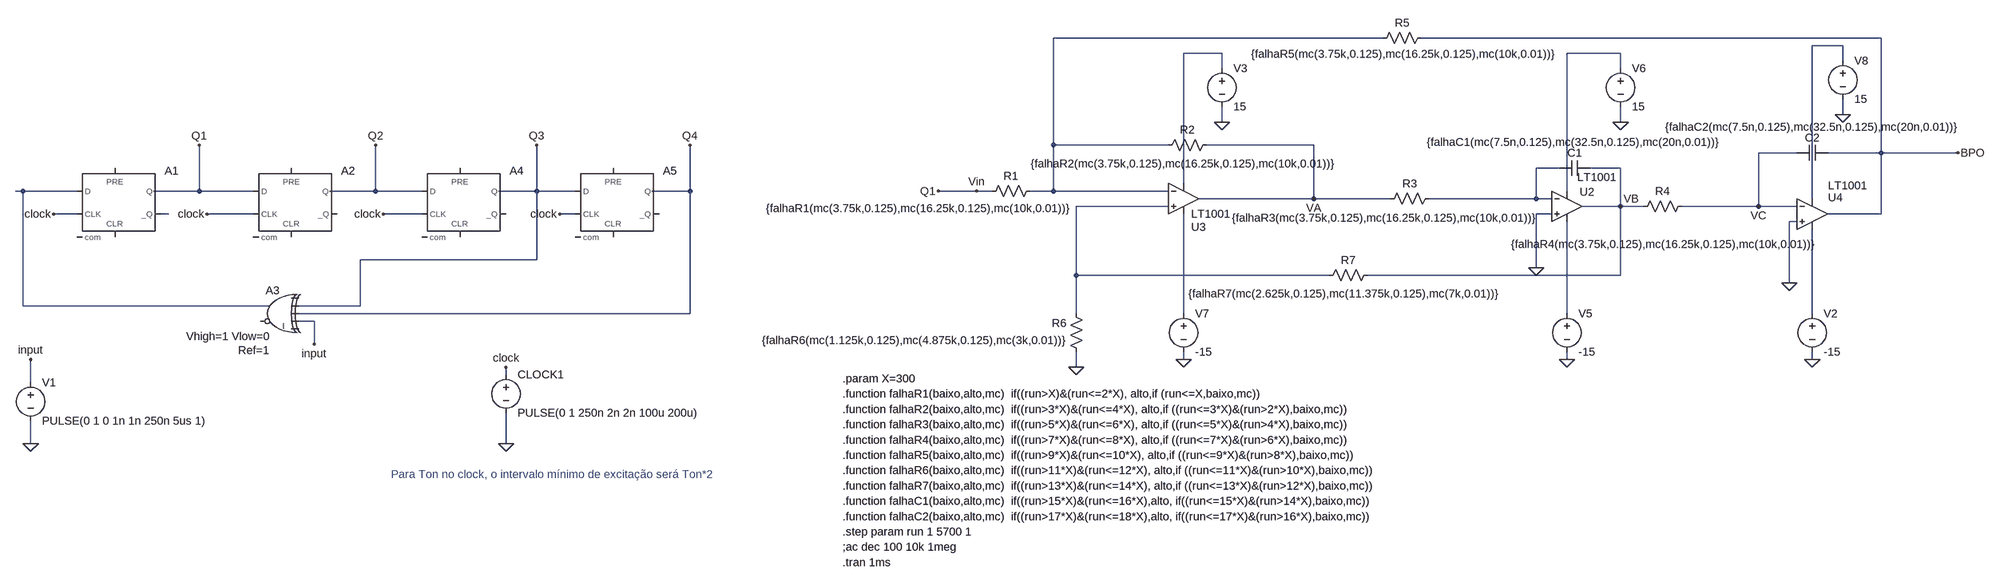
[diagram p0: schematic CTSV mc + 4bitPRBS [FALHA].asc]
CTSV mc + 4bitPRBS [FALHA].asc, the LTspice schematic file:
Version 4
SHEET 1 1748 1376
WIRE 448 -352 -240 -352
WIRE 1488 -352 528 -352
WIRE 1408 -336 1344 -336
WIRE 112 -320 32 -320
WIRE 944 -320 832 -320
WIRE 1408 -304 1408 -336
WIRE 112 -288 112 -320
WIRE 944 -288 944 -320
WIRE 1408 -192 1408 -224
WIRE 112 -176 112 -208
WIRE 944 -176 944 -208
WIRE -240 -128 -240 -352
WIRE 0 -128 -240 -128
WIRE 304 -128 80 -128
WIRE 1312 -112 1232 -112
WIRE 1488 -112 1488 -352
WIRE 1488 -112 1376 -112
WIRE 1648 -112 1488 -112
WIRE 816 -80 768 -80
WIRE 944 -80 880 -80
WIRE 32 -48 32 -320
WIRE -2832 -32 -2848 -32
WIRE -2720 -32 -2832 -32
WIRE -2464 -32 -2464 -128
WIRE -2464 -32 -2560 -32
WIRE -2352 -32 -2464 -32
WIRE -2096 -32 -2096 -128
WIRE -2096 -32 -2192 -32
WIRE -2000 -32 -2096 -32
WIRE -1760 -32 -1760 -128
WIRE -1760 -32 -1840 -32
WIRE -1680 -32 -1760 -32
WIRE -1440 -32 -1440 -128
WIRE -1440 -32 -1520 -32
WIRE -400 -32 -480 -32
WIRE -368 -32 -400 -32
WIRE -240 -32 -240 -128
WIRE -240 -32 -288 -32
WIRE 0 -32 -240 -32
WIRE 832 -32 832 -320
WIRE 304 -16 304 -128
WIRE 304 -16 64 -16
WIRE 464 -16 304 -16
WIRE 768 -16 768 -80
WIRE 768 -16 544 -16
WIRE 800 -16 768 -16
WIRE 1344 -16 1344 -336
WIRE 0 0 -192 0
WIRE 944 0 944 -80
WIRE 944 0 864 0
WIRE 992 0 944 0
WIRE 1232 0 1232 -112
WIRE 1232 0 1072 0
WIRE 1312 0 1232 0
WIRE -2720 16 -2768 16
WIRE -2528 16 -2544 16
WIRE -2352 16 -2448 16
WIRE -2000 16 -2080 16
WIRE -1680 16 -1712 16
WIRE 800 16 768 16
WIRE 1488 16 1488 -112
WIRE 1488 16 1376 16
WIRE 1312 32 1296 32
WIRE -1760 112 -1760 -32
WIRE -1760 112 -2128 112
WIRE 768 128 768 16
WIRE -192 144 -192 0
WIRE 336 144 -192 144
WIRE 944 144 944 0
WIRE 944 144 416 144
WIRE 1296 160 1296 32
WIRE -2832 208 -2832 -32
WIRE -2320 208 -2832 208
WIRE -2128 208 -2128 112
WIRE -2128 208 -2256 208
WIRE -1440 224 -1440 -32
WIRE -1440 224 -2256 224
WIRE -192 224 -192 144
WIRE 32 224 32 16
WIRE 832 224 832 32
WIRE 1344 224 1344 48
WIRE -2224 240 -2256 240
WIRE -2224 288 -2224 240
WIRE 32 320 32 304
WIRE 832 320 832 304
WIRE 1344 320 1344 304
WIRE -192 336 -192 304
WIRE -1824 352 -1824 336
WIRE -2816 368 -2816 320
WIRE -2816 496 -2816 448
WIRE -1824 496 -1824 432
FLAG -400 -32 Vin
FLAG 1344 320 0
FLAG 112 -176 0
FLAG -480 -32 Q1
FLAG 832 320 0
FLAG 944 -176 0
FLAG 32 320 0
FLAG 1408 -192 0
FLAG -192 336 0
FLAG 768 128 0
FLAG 1296 160 0
FLAG 1648 -112 BPO
FLAG 944 0 VB
FLAG 304 -16 VA
FLAG 1232 0 VC
FLAG -1824 496 0
FLAG -2768 16 clock
FLAG -1824 336 clock
FLAG -2448 16 clock
FLAG -2816 496 0
FLAG -2816 320 input
FLAG -2080 16 clock
FLAG -2464 -128 Q1
FLAG -2096 -128 Q2
FLAG -1760 -128 Q3
FLAG -1440 -128 Q4
FLAG -1712 16 clock
FLAG -2224 288 input
SYMBOL res -272 -48 R90
WINDOW 0 0 56 VBottom 2
WINDOW 3 37 250 VTop 2
SYMATTR InstName R1
SYMATTR Value {falhaR1(mc(3.75k,0.125),mc(16.25k,0.125),mc(10k,0.01))}
SYMBOL cap 880 -96 R90
WINDOW 0 0 32 VBottom 2
WINDOW 3 -54 34 VTop 2
SYMATTR InstName C1
SYMATTR Value {falhaC1(mc(7.5n,0.125),mc(32.5n,0.125),mc(20n,0.01))}
SYMBOL cap 1312 -96 R270
WINDOW 0 32 32 VTop 2
WINDOW 3 85 32 VBottom 2
SYMATTR InstName C2
SYMATTR Value {falhaC2(mc(7.5n,0.125),mc(32.5n,0.125),mc(20n,0.01))}
SYMBOL voltage 1344 208 R0
WINDOW 123 0 0 Left 2
WINDOW 39 0 0 Left 2
SYMATTR InstName V2
SYMATTR Value -15
SYMBOL voltage 112 -304 R0
WINDOW 123 0 0 Left 2
WINDOW 39 0 0 Left 2
SYMATTR InstName V3
SYMATTR Value 15
SYMBOL voltage 832 208 R0
WINDOW 123 0 0 Left 2
WINDOW 39 0 0 Left 2
SYMATTR InstName V5
SYMATTR Value -15
SYMBOL voltage 944 -304 R0
WINDOW 123 0 0 Left 2
WINDOW 39 0 0 Left 2
SYMATTR InstName V6
SYMATTR Value 15
SYMBOL voltage 32 208 R0
WINDOW 123 0 0 Left 2
WINDOW 39 0 0 Left 2
SYMATTR InstName V7
SYMATTR Value -15
SYMBOL voltage 1408 -320 R0
WINDOW 123 0 0 Left 2
WINDOW 39 0 0 Left 2
SYMATTR InstName V8
SYMATTR Value 15
SYMBOL Opamps\\LT1001 32 -80 R0
WINDOW 0 16 123 Left 2
SYMATTR InstName U3
SYMBOL res 96 -144 R90
WINDOW 0 0 56 VBottom 2
WINDOW 3 39 65 VTop 2
SYMATTR InstName R2
SYMATTR Value {falhaR2(mc(3.75k,0.125),mc(16.25k,0.125),mc(10k,0.01))}
SYMBOL res 544 -368 R90
WINDOW 0 0 56 VBottom 2
WINDOW 3 34 53 VTop 2
SYMATTR InstName R5
SYMATTR Value {falhaR5(mc(3.75k,0.125),mc(16.25k,0.125),mc(10k,0.01))}
SYMBOL res 432 128 R90
WINDOW 0 0 56 VBottom 2
WINDOW 3 39 65 VTop 2
SYMATTR InstName R7
SYMATTR Value {falhaR7(mc(2.625k,0.125),mc(11.375k,0.125),mc(7k,0.01))}
SYMBOL res -176 320 R180
WINDOW 0 36 76 Left 2
WINDOW 3 36 40 Left 2
SYMATTR InstName R6
SYMATTR Value {falhaR6(mc(1.125k,0.125),mc(4.875k,0.125),mc(3k,0.01))}
SYMBOL Opamps\\LT1001 832 -64 R0
WINDOW 0 27 34 Left 2
WINDOW 3 22 3 Left 2
SYMATTR InstName U2
SYMBOL res 560 -32 R90
WINDOW 0 0 56 VBottom 2
WINDOW 3 41 109 VTop 2
SYMATTR InstName R3
SYMATTR Value {falhaR3(mc(3.75k,0.125),mc(16.25k,0.125),mc(10k,0.01))}
SYMBOL res 1088 -16 R90
WINDOW 0 0 56 VBottom 2
WINDOW 3 80 55 VTop 2
SYMATTR InstName R4
SYMATTR Value {falhaR4(mc(3.75k,0.125),mc(16.25k,0.125),mc(10k,0.01))}
SYMBOL Opamps\\LT1001 1344 -48 R0
WINDOW 0 33 30 Left 2
WINDOW 3 33 5 Left 2
SYMATTR InstName U4
SYMBOL voltage -1824 336 R0
WINDOW 123 0 0 Left 2
WINDOW 39 0 0 Left 2
SYMATTR InstName CLOCK1
SYMATTR Value PULSE(0 1 250n 2n 2n 100u 200u)
SYMBOL Digital\\dflop -2640 -80 R0
WINDOW 3 0 0 Invisible 2
SYMATTR Value td=20n
SYMATTR InstName A1
SYMATTR Value2 Ref=1 Vhigh=10 Vlow=0
SYMBOL Digital\\dflop -2272 -80 R0
WINDOW 3 0 0 Invisible 2
SYMATTR Value Ref=1 Vhigh=3 Vlow=0
SYMATTR InstName A2
SYMATTR Value2 td=20n
SYMBOL Digital\\xor -2304 160 M0
WINDOW 3 14 141 Left 2
WINDOW 123 12 112 Left 2
SYMATTR Value Ref=1
SYMATTR Value2 Vhigh=1 Vlow=0
SYMATTR InstName A3
SYMATTR SpiceLine2 tripdt=5n
SYMATTR SpiceLine Td=5n
SYMBOL Digital\\dflop -1920 -80 R0
WINDOW 3 0 0 Invisible 2
SYMATTR Value Ref=1 Vhigh=2 Vlow=0
SYMATTR InstName A4
SYMATTR Value2 td=20n
SYMBOL Digital\\dflop -1600 -80 R0
WINDOW 3 0 0 Invisible 2
SYMATTR Value Ref=1 Vhigh=4 Vlow=0
SYMATTR InstName A5
SYMATTR Value2 td=20n
SYMBOL voltage -2816 352 R0
WINDOW 123 0 0 Left 2
WINDOW 39 0 0 Left 2
SYMATTR InstName V1
SYMATTR Value PULSE(0 1 0 1n 1n 250n 5us 1)
TEXT -680 712 Left 2 !;ac dec 100 10k 1meg
TEXT -680 680 Left 2 !.step param run 1 5700 1
TEXT -680 744 Left 2 !.tran 1ms
TEXT -680 392 Left 2 !.function falhaR1(baixo,alto,mc)  if((run>X)&(run<=2*X), alto,if (run<=X,baixo,mc))
TEXT -680 424 Left 2 !.function falhaR2(baixo,alto,mc)  if((run>3*X)&(run<=4*X), alto,if ((run<=3*X)&(run>2*X),baixo,mc))
TEXT -680 456 Left 2 !.function falhaR3(baixo,alto,mc)  if((run>5*X)&(run<=6*X), alto,if ((run<=5*X)&(run>4*X),baixo,mc))
TEXT -680 648 Left 2 !.function falhaC2(baixo,alto,mc)  if((run>17*X)&(run<=18*X),alto, if((run<=17*X)&(run>16*X),baixo,mc))
TEXT -680 616 Left 2 !.function falhaC1(baixo,alto,mc)  if((run>15*X)&(run<=16*X),alto, if((run<=15*X)&(run>14*X),baixo,mc))
TEXT -680 360 Left 2 !.param X=300
TEXT -680 488 Left 2 !.function falhaR4(baixo,alto,mc)  if((run>7*X)&(run<=8*X), alto,if ((run<=7*X)&(run>6*X),baixo,mc))
TEXT -680 520 Left 2 !.function falhaR5(baixo,alto,mc)  if((run>9*X)&(run<=10*X), alto,if ((run<=9*X)&(run>8*X),baixo,mc))
TEXT -680 552 Left 2 !.function falhaR6(baixo,alto,mc)  if((run>11*X)&(run<=12*X), alto,if ((run<=11*X)&(run>10*X),baixo,mc))
TEXT -680 584 Left 2 !.function falhaR7(baixo,alto,mc)  if((run>13*X)&(run<=14*X), alto,if ((run<=13*X)&(run>12*X),baixo,mc))
TEXT -2064 560 Left 2 ;Para Ton no clock, o intervalo mínimo de excitação será Ton*2

The netlist it stands for:
* CTSV mc + 4bitPRBS [FALHA].asc
R1 N001 Q1 {falhaR1(mc(3.75k,0.125),mc(16.25k,0.125),mc(10k,0.01))}
C1 VB N005 {falhaC1(mc(7.5n,0.125),mc(32.5n,0.125),mc(20n,0.01))}
C2 VC BPO {falhaC2(mc(7.5n,0.125),mc(32.5n,0.125),mc(20n,0.01))}
V2 N011 0 -15
V3 N003 0 15
V5 N010 0 -15
V6 N004 0 15
V7 N009 0 -15
V8 N002 0 15
XU3 N007 N001 N003 N009 VA LT1001  ; pins In+ In- V+ V- OUT
R2 VA N001 {falhaR2(mc(3.75k,0.125),mc(16.25k,0.125),mc(10k,0.01))}
R5 BPO N001 {falhaR5(mc(3.75k,0.125),mc(16.25k,0.125),mc(10k,0.01))}
R7 VB N007 {falhaR7(mc(2.625k,0.125),mc(11.375k,0.125),mc(7k,0.01))}
R6 0 N007 {falhaR6(mc(1.125k,0.125),mc(4.875k,0.125),mc(3k,0.01))}
XU2 0 N005 N004 N010 VB LT1001  ; pins In+ In- V+ V- OUT
R3 N005 VA {falhaR3(mc(3.75k,0.125),mc(16.25k,0.125),mc(10k,0.01))}
R4 VC VB {falhaR4(mc(3.75k,0.125),mc(16.25k,0.125),mc(10k,0.01))}
XU4 0 VC N002 N011 BPO LT1001  ; pins In+ In- V+ V- OUT
V§CLOCK1 clock 0 PULSE(0 1 250n 2n 2n 100u 200u)
A1 N006 0 clock 0 0 N008 Q1 0 DFLOP td=20n Ref=1 Vhigh=10 Vlow=0
A2 Q1 0 clock 0 0 0 Q2 0 DFLOP Ref=1 Vhigh=3 Vlow=0 td=20n
A3 0 Q3 Q4 input 0 0 N006 0 XOR Ref=1 Vhigh=1 Vlow=0 Td=5n tripdt=5n
A4 Q2 0 clock 0 0 0 Q3 0 DFLOP Ref=1 Vhigh=2 Vlow=0 td=20n
A5 Q3 0 clock 0 0 0 Q4 0 DFLOP Ref=1 Vhigh=4 Vlow=0 td=20n
V1 input 0 PULSE(0 1 0 1n 1n 250n 5us 1)
;ac dec 100 10k 1meg
.step param run 1 5700 1
.tran 1ms
.function falhaR1(baixo,alto,mc)  if((run>X)&(run<=2*X), alto,if (run<=X,baixo,mc))
.function falhaR2(baixo,alto,mc)  if((run>3*X)&(run<=4*X), alto,if ((run<=3*X)&(run>2*X),baixo,mc))
.function falhaR3(baixo,alto,mc)  if((run>5*X)&(run<=6*X), alto,if ((run<=5*X)&(run>4*X),baixo,mc))
.function falhaC2(baixo,alto,mc)  if((run>17*X)&(run<=18*X),alto, if((run<=17*X)&(run>16*X),baixo,mc))
.function falhaC1(baixo,alto,mc)  if((run>15*X)&(run<=16*X),alto, if((run<=15*X)&(run>14*X),baixo,mc))
.param X=300
.function falhaR4(baixo,alto,mc)  if((run>7*X)&(run<=8*X), alto,if ((run<=7*X)&(run>6*X),baixo,mc))
.function falhaR5(baixo,alto,mc)  if((run>9*X)&(run<=10*X), alto,if ((run<=9*X)&(run>8*X),baixo,mc))
.function falhaR6(baixo,alto,mc)  if((run>11*X)&(run<=12*X), alto,if ((run<=11*X)&(run>10*X),baixo,mc))
.function falhaR7(baixo,alto,mc)  if((run>13*X)&(run<=14*X), alto,if ((run<=13*X)&(run>12*X),baixo,mc))
* Para Ton no clock, o intervalo mínimo de excitação será Ton*2
.lib LTC.lib
.backanno
.end